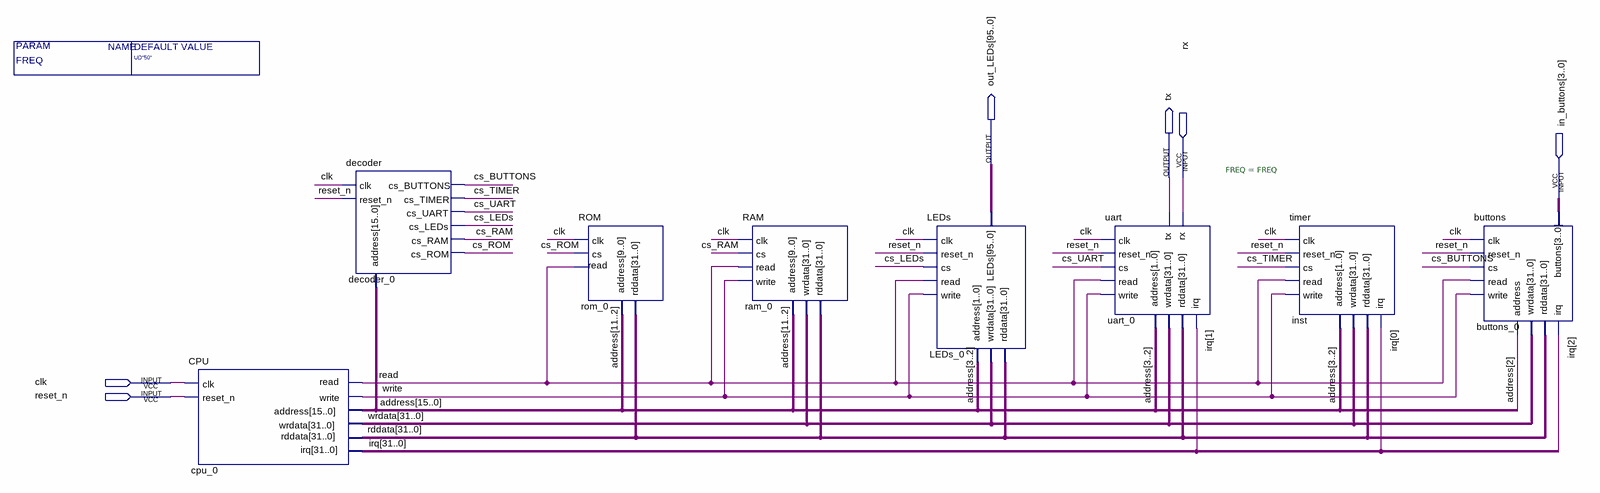
[diagram p0: schematic sheet]
// Quartus schematic GECKO.bdf as structural Verilog: 8 symbols, 6 pins
module GECKO #(parameter FREQ = "UD\"50\"") (
  input  rx,
  input  [3:0] in_buttons,
  input  clk,
  input  reset_n,
  output [95:0] out_LEDs,
  output tx
);

  wire cs_BUTTONS, cs_LEDs, cs_RAM, cs_ROM, cs_TIMER, cs_UART, read, write;
  wire [15:0] address;
  wire [31:0] irq, rddata, wrdata;

  CPU cpu_0 (
    .clk(clk), .reset_n(reset_n), .rddata(rddata), .irq(irq), .write(write), .wrdata(wrdata),
    .address(address), .read(read));
  decoder decoder_0 (
    .clk(clk), .reset_n(reset_n), .address(address), .cs_RAM(cs_RAM), .cs_LEDs(cs_LEDs), .cs_UART(cs_UART),
    .cs_TIMER(cs_TIMER), .cs_BUTTONS(cs_BUTTONS), .cs_ROM(cs_ROM));
  ROM rom_0 (.clk(clk), .cs(cs_ROM), .read(read), .address(address[11:2]), .rddata(rddata));
  RAM ram_0 (
    .clk(clk), .cs(cs_RAM), .write(write), .wrdata(wrdata), .read(read), .address(address[11:2]),
    .rddata(rddata));
  LEDs LEDs_0 (
    .clk(clk), .reset_n(reset_n), .cs(cs_LEDs), .write(write), .address(address[3:2]), .wrdata(wrdata),
    .read(read), .rddata(rddata), .LEDs(out_LEDs));
  uart #(.FREQ(FREQ)) uart_0 (
    .clk(clk), .reset_n(reset_n), .cs(cs_UART), .write(write), .address(address[3:2]), .wrdata(wrdata),
    .rx(rx), .read(read), .irq(irq[1]), .rddata(rddata), .tx(tx));
  timer inst (
    .clk(clk), .reset_n(reset_n), .cs(cs_TIMER), .write(write), .address(address[3:2]), .wrdata(wrdata),
    .read(read), .irq(irq[0]), .rddata(rddata));
  buttons buttons_0 (
    .clk(clk), .reset_n(reset_n), .cs(cs_BUTTONS), .write(write), .address(address[2]), .wrdata(wrdata),
    .buttons(in_buttons), .read(read), .irq(irq[2]), .rddata(rddata));
endmodule
